# EAGLE design 74clock (EAGLE 5.09)
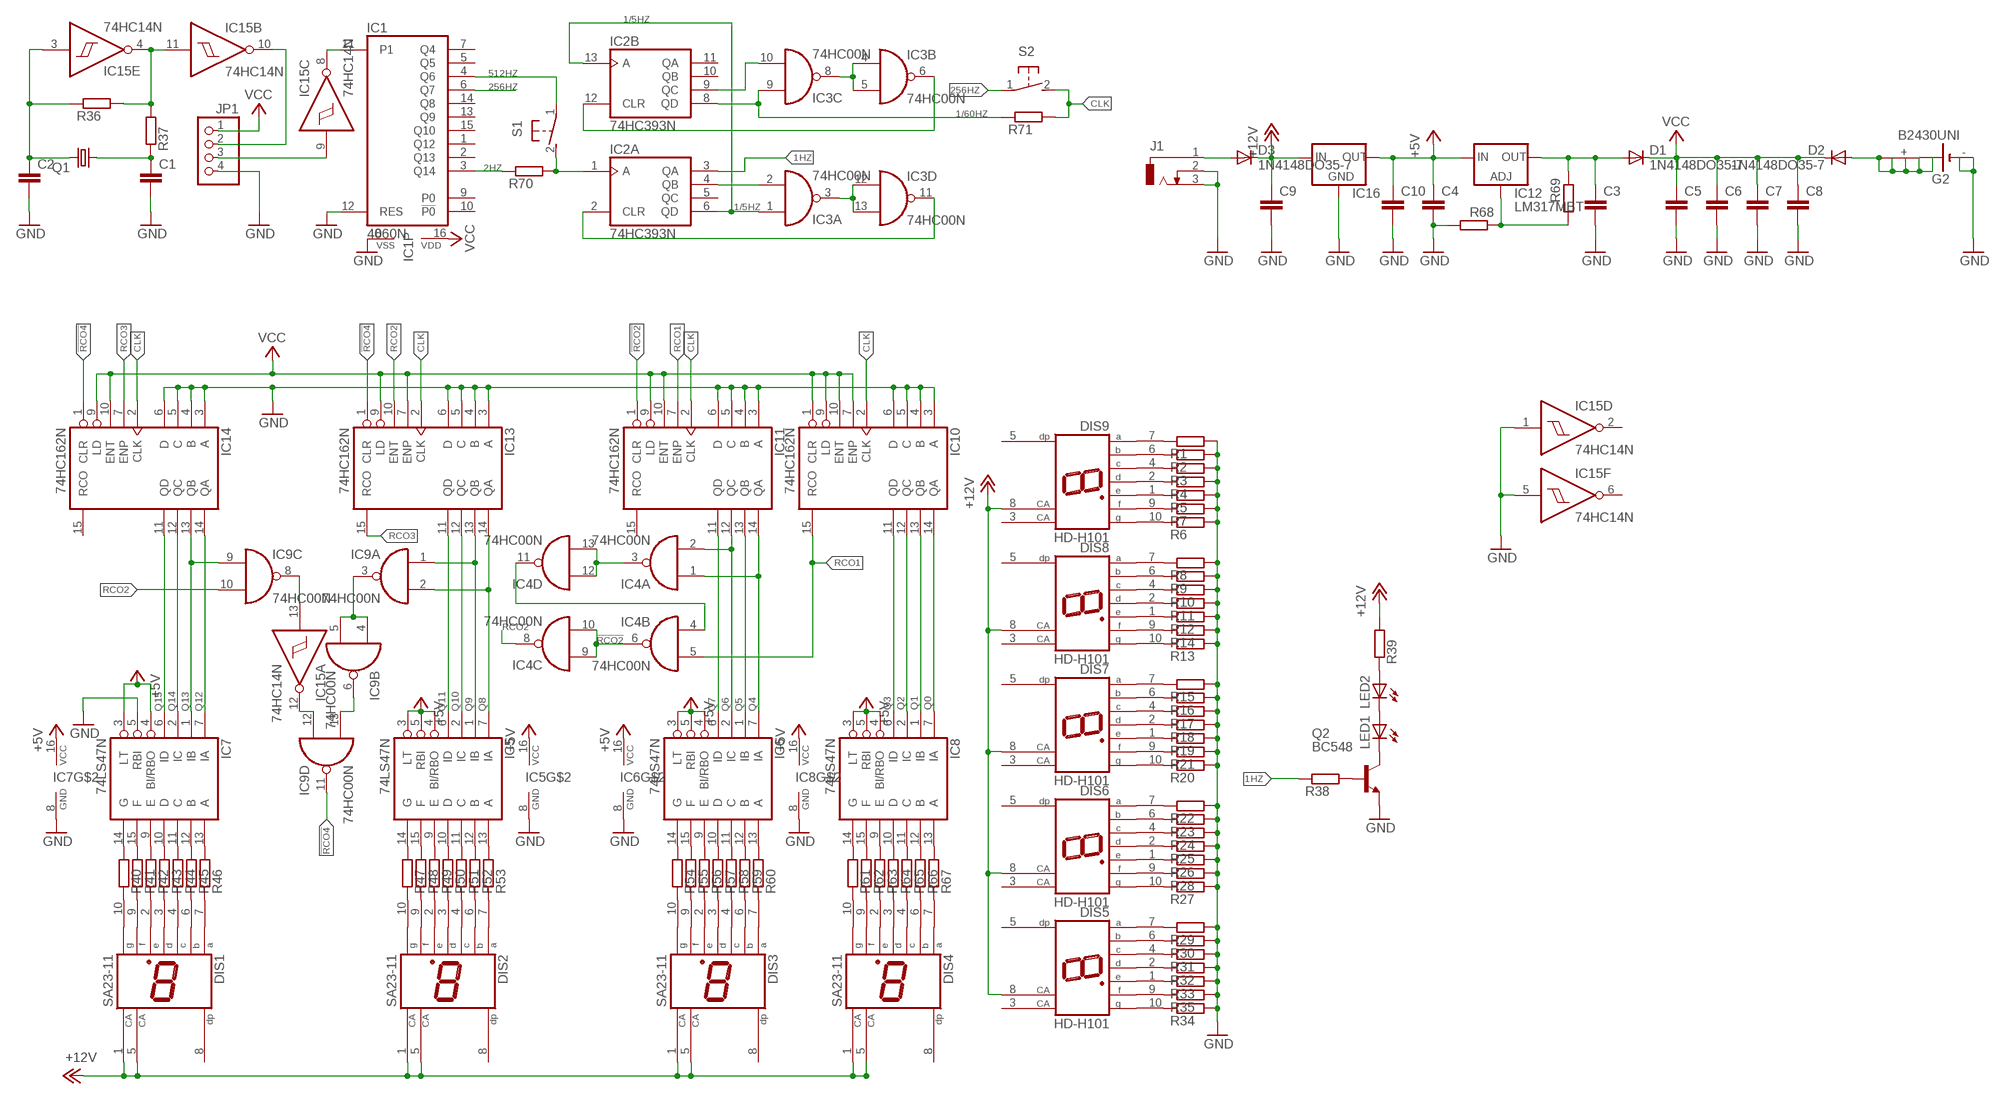
[diagram p0: schematic, sheet 1]

## Parts
C1  C-EU050-024X044  [C050-024X044]
C2  C-EU050-024X044  [C050-024X044]
C3  C-EU050-025X075  [C050-025X075]
C4  C-EU050-025X075  [C050-025X075]
C5  C-EU050-025X075  [C050-025X075]
C6  C-EU050-025X075  [C050-025X075]
C7  C-EU050-025X075  [C050-025X075]
C8  C-EU050-025X075  [C050-025X075]
C9  C-EU050-025X075  [C050-025X075]
C10  C-EU050-025X075  [C050-025X075]
D1  1N4148DO35-7  [DO35-7]
D2  1N4148DO35-7  [DO35-7]
D3  1N4148DO35-7  [DO35-7]
DIS1  SA23-11  [SX23-XX]
DIS2  SA23-11  [SX23-XX]
DIS3  SA23-11  [SX23-XX]
DIS4  SA23-11  [SX23-XX]
DIS5  HD-H101  [HDSP-M]
DIS6  HD-H101  [HDSP-M]
DIS7  HD-H101  [HDSP-M]
DIS8  HD-H101  [HDSP-M]
DIS9  HD-H101  [HDSP-M]
G2  B2430UNI  [B2430UNI]
IC1  4060N  [DIL16]
IC2  74HC393N  [DIL14]
IC3  74HC00N  [DIL14]
IC4  74HC00N  [DIL14]
IC5  74LS47N  [DIL16]
IC6  74LS47N  [DIL16]
IC7  74LS47N  [DIL16]
IC8  74LS47N  [DIL16]
IC9  74HC00N  [DIL14]
IC10  74HC162N  74HC160N  [DIL16]
IC11  74HC162N  74HC160N  [DIL16]
IC12  LM317MBT  [TO220L1]
IC13  74HC162N  74HC160N  [DIL16]
IC14  74HC162N  74HC160N  [DIL16]
IC15  74HC14N  [DIL14]
IC16  78XXL  [78XXL]
J1  DCJ0303  [DCJ0303]
JP1  PINHD-1X4/90  [1X04/90]
LED1  LED5MM  [LED5MM]
LED2  LED5MM  [LED5MM]
Q1  CRYSTALTC38H  [TC38H]
Q2  BC548  [TO92-EBC]
R1  R-EU_0204/5  [0204/5]
R2  R-EU_0204/5  [0204/5]
R3  R-EU_0204/5  [0204/5]
R4  R-EU_0204/5  [0204/5]
R5  R-EU_0204/5  [0204/5]
R6  R-EU_0204/5  [0204/5]
R7  R-EU_0204/5  [0204/5]
R8  R-EU_0204/5  [0204/5]
R9  R-EU_0204/5  [0204/5]
R10  R-EU_0204/5  [0204/5]
R11  R-EU_0204/5  [0204/5]
R12  R-EU_0204/5  [0204/5]
R13  R-EU_0204/5  [0204/5]
R14  R-EU_0204/5  [0204/5]
R15  R-EU_0204/5  [0204/5]
R16  R-EU_0204/5  [0204/5]
R17  R-EU_0204/5  [0204/5]
R18  R-EU_0204/5  [0204/5]
R19  R-EU_0204/5  [0204/5]
R20  R-EU_0204/5  [0204/5]
R21  R-EU_0204/5  [0204/5]
R22  R-EU_0204/5  [0204/5]
R23  R-EU_0204/5  [0204/5]
R24  R-EU_0204/5  [0204/5]
R25  R-EU_0204/5  [0204/5]
R26  R-EU_0204/5  [0204/5]
R27  R-EU_0204/5  [0204/5]
R28  R-EU_0204/5  [0204/5]
R29  R-EU_0204/5  [0204/5]
R30  R-EU_0204/5  [0204/5]
R31  R-EU_0204/5  [0204/5]
R32  R-EU_0204/5  [0204/5]
R33  R-EU_0204/5  [0204/5]
R34  R-EU_0204/5  [0204/5]
R35  R-EU_0204/5  [0204/5]
R36  R-EU_0204/5  [0204/5]
R37  R-EU_0204/5  [0204/5]
R38  R-EU_0204/5  [0204/5]
R39  R-EU_0204/5  [0204/5]
R40  R-EU_0204/5  [0204/5]
R41  R-EU_0204/5  [0204/5]
R42  R-EU_0204/5  [0204/5]
R43  R-EU_0204/5  [0204/5]
R44  R-EU_0204/5  [0204/5]
R45  R-EU_0204/5  [0204/5]
R46  R-EU_0204/5  [0204/5]
R47  R-EU_0204/5  [0204/5]
R48  R-EU_0204/5  [0204/5]
R49  R-EU_0204/5  [0204/5]
R50  R-EU_0204/5  [0204/5]
R51  R-EU_0204/5  [0204/5]
R52  R-EU_0204/5  [0204/5]
R53  R-EU_0204/5  [0204/5]
R54  R-EU_0204/5  [0204/5]
R55  R-EU_0204/5  [0204/5]
R56  R-EU_0204/5  [0204/5]
R57  R-EU_0204/5  [0204/5]
R58  R-EU_0204/5  [0204/5]
R59  R-EU_0204/5  [0204/5]
R60  R-EU_0204/5  [0204/5]
R61  R-EU_0204/5  [0204/5]
R62  R-EU_0204/5  [0204/5]
R63  R-EU_0204/5  [0204/5]
R64  R-EU_0204/5  [0204/5]
R65  R-EU_0204/5  [0204/5]
R66  R-EU_0204/5  [0204/5]
R67  R-EU_0204/5  [0204/5]
R68  R-EU_0204/5  [0204/5]
R69  R-EU_0204/5  [0204/5]
R70  R-EU_0204/5  [0204/5]
R71  R-EU_0204/5  [0204/5]
S1  31-XX  [B3F-31XX]
S2  31-XX  [B3F-31XX]

## Nets
1/5HZ: IC2.6(A:QD) IC2.13(B:A) IC3.1(A:I0)
1/60HZ: IC2.8(B:QD) IC3.9(C:I0) R71.1
1HZ: IC2.3(A:QA) R38.1
2HZ: IC1.3(Q14) R70.1
256HZ: IC1.6(Q7) S2.1(P)
512HZ: IC1.4(Q6) S1.1(P)
!RCO2: IC4.6(B:O) IC4.9(C:I0) IC4.10(C:I1) IC11.1(CLR)
!RCO4: IC9.11(D:O) IC13.1(CLR) IC14.1(CLR)
+5V: C4.1 C10.1 IC5.3(LT) IC5.4(BI/RBO) IC5.5(RBI) IC5.16(VCC) IC6.3(LT) IC6.4(BI/RBO) IC6.5(RBI) IC6.16(VCC) IC7.3(LT) IC7.4(BI/RBO) IC7.16(VCC) IC8.3(LT) IC8.4(BI/RBO) IC8.5(RBI) IC8.16(VCC) IC12.3(IN) IC16.OUT
+12V: C9.1 D3.C DIS1.1(CA) DIS1.5(CA) DIS2.1(CA) DIS2.5(CA) DIS3.1(CA) DIS3.5(CA) DIS4.1(CA) DIS4.5(CA) DIS5.8(CA) DIS6.8(CA) DIS7.8(CA) DIS8.8(CA) DIS9.8(CA) IC16.IN R39.2
CLK: IC10.2(CLK) IC11.2(CLK) IC13.2(CLK) IC14.2(CLK) R71.2 S2.2(S)
GND: C1.2 C2.2 C3.2 C4.2 C5.2 C6.2 C7.2 C8.2 C9.2 C10.2 G2.- G2.-@1(-) IC1.8(VSS) IC1.12(RES) IC5.8(GND) IC6.8(GND) IC7.5(RBI) IC7.8(GND) IC8.8(GND) IC10.3(A) IC10.4(B) IC10.5(C) IC10.6(D) IC11.3(A) IC11.4(B) IC11.5(C) IC11.6(D) IC13.3(A) IC13.4(B) IC13.5(C) IC13.6(D) IC14.3(A) IC14.4(B) IC14.5(C) IC14.6(D) IC15.1(D:I) IC15.5(F:I) IC16.GND J1.2 J1.3 JP1.4 Q2.E R1.2 R2.2 R3.2 R4.2 R5.2 R6.2 R7.2 R8.2 R9.2 R10.2 R11.2 R12.2 R13.2 R14.2 R15.2 R16.2 R17.2 R18.2 R19.2 R20.2 R21.2 R22.2 R23.2 R24.2 R25.2 R26.2 R27.2 R28.2 R29.2 R30.2 R31.2 R32.2 R33.2 R34.2 R35.2 R68.2
N$1: C3.1 D1.A IC12.2(OUT) R69.1
N$2: IC2.4(A:QB) IC3.2(A:I1)
N$3: IC2.9(B:QC) IC3.10(C:I1)
N$4: DIS9.7(A) R1.1
N$5: IC7.14(G) R40.2
N$6: DIS1.10(G) R40.1
N$7: IC7.15(F) R41.2
N$8: DIS1.9(F) R41.1
N$9: IC7.9(E) R42.2
N$10: DIS1.2(E) R42.1
N$11: IC7.10(D) R43.2
N$12: DIS9.6(B) R2.1
N$13: DIS9.4(C) R3.1
N$14: DIS9.2(D) R4.1
N$15: DIS9.1(E) R5.1
N$16: DIS9.10(G) R6.1
N$17: DIS9.9(F) R7.1
N$18: DIS8.7(A) R8.1
N$19: DIS8.6(B) R9.1
N$20: DIS8.4(C) R10.1
N$21: DIS8.2(D) R11.1
N$22: DIS8.1(E) R12.1
N$23: DIS8.10(G) R13.1
N$24: DIS1.3(D) R43.1
N$25: IC7.11(C) R44.2
N$26: DIS1.4(C) R44.1
N$27: IC7.12(B) R45.2
N$28: DIS1.6(B) R45.1
N$29: IC7.13(A) R46.2
N$30: DIS1.7(A) R46.1
N$31: DIS2.10(G) R47.1
N$32: DIS2.9(F) R48.1
N$33: DIS2.2(E) R49.1
N$34: DIS2.3(D) R50.1
N$35: DIS2.4(C) R51.1
N$36: DIS2.6(B) R52.1
N$37: DIS2.7(A) R53.1
N$38: IC5.14(G) R47.2
N$39: IC5.15(F) R48.2
N$40: IC5.9(E) R49.2
N$41: IC5.10(D) R50.2
N$42: IC5.11(C) R51.2
N$43: IC5.12(B) R52.2
N$44: IC5.13(A) R53.2
N$45: DIS8.9(F) R14.1
N$46: DIS7.7(A) R15.1
N$47: DIS7.6(B) R16.1
N$48: DIS7.4(C) R17.1
N$49: DIS7.2(D) R18.1
N$50: DIS7.1(E) R19.1
N$51: DIS7.10(G) R20.1
N$52: DIS7.9(F) R21.1
N$53: DIS6.7(A) R22.1
N$54: DIS6.6(B) R23.1
N$55: DIS6.4(C) R24.1
N$56: DIS6.2(D) R25.1
N$57: DIS6.1(E) R26.1
N$58: DIS6.10(G) R27.1
N$59: DIS6.9(F) R28.1
N$60: DIS5.7(A) R29.1
N$61: DIS5.6(B) R30.1
N$62: DIS5.4(C) R31.1
N$63: DIS5.2(D) R32.1
N$64: DIS5.1(E) R33.1
N$65: DIS5.10(G) R34.1
N$66: DIS5.9(F) R35.1
N$67: IC15.9(C:I) JP1.3
N$68: IC15.10(B:O) JP1.2
N$69: IC4.3(A:O) IC4.12(D:I0) IC4.13(D:I1)
N$70: D3.A J1.1
N$71: IC4.4(B:I0) IC4.11(D:O)
N$72: IC9.8(C:O) IC15.13(A:I)
N$73: IC9.3(A:O) IC9.4(B:I0) IC9.5(B:I1)
N$74: IC9.6(B:O) IC9.13(D:I1)
N$75: IC9.12(D:I0) IC15.12(A:O)
N$77: IC3.3(A:O) IC3.12(D:I0) IC3.13(D:I1)
N$78: C2.1 IC15.3(E:I) Q1.2 R36.1
N$79: C1.1 Q1.1 R37.1
N$80: Q2.B R38.2
N$81: IC15.4(E:O) IC15.11(B:I) R36.2 R37.2
N$82: LED1.K(C) Q2.C
N$83: LED1.A LED2.K(C)
N$84: LED2.A R39.1
N$86: IC2.2(A:CLR) IC3.11(D:O)
N$87: IC1.11(P1) IC15.8(C:O)
N$88: DIS3.10(G) R54.1
N$89: IC3.4(B:I0) IC3.5(B:I1) IC3.8(C:O)
N$90: IC2.12(B:CLR) IC3.6(B:O)
N$91: DIS3.9(F) R55.1
N$92: DIS3.2(E) R56.1
N$93: DIS3.3(D) R57.1
N$94: DIS3.4(C) R58.1
N$95: DIS3.6(B) R59.1
N$96: DIS3.7(A) R60.1
N$97: IC6.14(G) R54.2
N$98: IC6.15(F) R55.2
N$99: IC6.9(E) R56.2
N$100: IC6.10(D) R57.2
N$101: IC6.11(C) R58.2
N$102: IC6.12(B) R59.2
N$103: IC6.13(A) R60.2
N$104: DIS4.10(G) R61.1
N$105: DIS4.9(F) R62.1
N$106: DIS4.2(E) R63.1
N$107: DIS4.3(D) R64.1
N$108: DIS4.4(C) R65.1
N$109: DIS4.6(B) R66.1
N$110: DIS4.7(A) R67.1
N$111: IC8.14(G) R61.2
N$112: IC8.15(F) R62.2
N$113: IC8.9(E) R63.2
N$114: IC8.10(D) R64.2
N$115: IC8.11(C) R65.2
N$116: IC8.12(B) R66.2
N$117: IC8.13(A) R67.2
N$118: IC12.1(ADJ) R68.1 R69.2
N$119: D2.A G2.+ G2.+@1(+) G2.+@2(+) G2.+@3(+) G2.+@4(+)
N$121: IC2.1(A:A) R70.2 S1.2(S)
Q0: IC8.7(IA) IC10.14(QA)
Q1: IC8.1(IB) IC10.13(QB)
Q2: IC8.2(IC) IC10.12(QC)
Q3: IC8.6(ID) IC10.11(QD)
Q4: IC4.1(A:I0) IC6.7(IA) IC11.14(QA)
Q5: IC6.1(IB) IC11.13(QB)
Q6: IC4.2(A:I1) IC6.2(IC) IC11.12(QC)
Q7: IC6.6(ID) IC11.11(QD)
Q8: IC5.7(IA) IC9.2(A:I1) IC13.14(QA)
Q9: IC5.1(IB) IC9.1(A:I0) IC13.13(QB)
Q10: IC5.2(IC) IC13.12(QC)
Q11: IC5.6(ID) IC13.11(QD)
Q12: IC7.7(IA) IC14.14(QA)
Q13: IC7.1(IB) IC9.9(C:I0) IC14.13(QB)
Q14: IC7.2(IC) IC14.12(QC)
Q15: IC7.6(ID) IC14.11(QD)
RCO1: IC4.5(B:I1) IC10.15(RCO) IC11.7(ENP)
RCO2: IC4.8(C:O) IC9.10(C:I1) IC13.10(ENT)
RCO3: IC13.15(RCO) IC14.7(ENP)
VCC: C5.1 C6.1 C7.1 C8.1 D1.C D2.C IC1.16(VDD) IC10.1(CLR) IC10.7(ENP) IC10.9(LD) IC10.10(ENT) IC11.9(LD) IC11.10(ENT) IC13.7(ENP) IC13.9(LD) IC14.9(LD) IC14.10(ENT) JP1.1
Unconnected: DIS1.8(DP) DIS2.8(DP) DIS3.8(DP) DIS4.8(DP) DIS5.3(CA) DIS5.5(DP) DIS6.3(CA) DIS6.5(DP) DIS7.3(CA) DIS7.5(DP) DIS8.3(CA) DIS8.5(DP) DIS9.3(CA) DIS9.5(DP) IC1.1(Q12) IC1.2(Q13) IC1.5(Q5) IC1.7(Q4) IC1.9(P0) IC1.10(!P0) IC1.13(Q9) IC1.14(Q8) IC1.15(Q10) IC2.5(A:QC) IC2.10(B:QB) IC2.11(B:QA) IC11.15(RCO) IC14.15(RCO) IC15.2(D:O) IC15.6(F:O)

## Power pins joined to a net without a drawn wire
GND: IC2.7(P:GND) IC3.7(P:GND) IC4.7(P:GND) IC9.7(P:GND) IC10.8(GND) IC11.8(GND) IC13.8(GND) IC14.8(GND) IC15.7(P:GND)
VCC: IC2.14(P:VCC) IC3.14(P:VCC) IC4.14(P:VCC) IC9.14(P:VCC) IC10.16(VCC) IC11.16(VCC) IC13.16(VCC) IC14.16(VCC) IC15.14(P:VCC)

## Library data of the parts
C1-C10 = rcl:C-EU: CAPACITOR, European symbol
D1-D3 = diode:1N4148: DIODE high speed (Philips)
DIS1-DIS4 = display-kingbright:SA23-11: LED DISPLAY 1-character 7 segment, decimal point right
DIS5-DIS9 = display-hp:HD-H101: LED DISPLAY 1-character 7 segment, decimal point right
G2 = battery:B2430UNI: LI BATTERY
IC1 = 40xx:4060: 14-stage binary/ripple COUNTER
IC2 = 74xx-eu:74*393: Dual 4-bit decade and binary COUNTER
IC3 IC4 IC9 = 74xx-eu:74*00: Quad 2-input NAND gate
IC5-IC8 = 74xx-eu:74*47: BCD to seven segment DECODER/DRIVER Source: http://www.ee.washington.edu/stores/DataSheets/74ls/74ls47.pdf
IC10 IC11 IC13 IC14 = 74xx-eu:74*160: Synchronous 4-bit COUNTER
IC12 = v-reg:LM317?*: 500 mA Adjustable Output Positive Voltage Regulator Source: http://www.onsemi.co.jp .. LM317M-D.PDF
IC15 = 74xx-eu:74*14: Hex schmitt trigger INVERTER
IC16 = v-reg:78XXL: VOLTAGE REGULATOR
J1 = con-jack:DCJ0303: DC POWER JACK Source: DCJ0303.pdf
JP1 = pinhead:PINHD-1X4: PIN HEADER
LED1 LED2 = led:LED: LED OSRAM: - CHIPLED LG R971, LG N971, LY N971, LG Q971, LY Q971, LO R971, LY R971 LH N974, LH R974 LS Q976, LO Q976, LY Q976 LO Q996 - Hyper CHIPLED LW Q18S LB Q993, LB Q99A, LB R99A - SideLED LS A670, LO A670, LY A670, LG A670, LP A670 LB A673, LV A673, LT A673, LW A673 LH A674 LY A675 LS A676, LA A676, LO A676, LY A676, LW A676 LS A679, LY A679, LG A679 - Hyper Micro SIDELED® LS Y876, LA Y876, LO Y876, LY Y876 LT Y87S - SmartLED LW L88C, LW L88S LB L89C, LB L89S, LG L890 LS L89K, LO L89K, LY L89K LS L896, LA L896, LO L896, LY L896 - TOPLED LS T670, LO T670, LY T670, LG T670, LP T670 LSG T670, LSP T670, LSY T670, LOP T670, LYG T670 LG T671, LOG T671, LSG T671 LB T673, LV T673, LT T673, LW T673 LH T674 LS T676, LA T676, LO T676, LY T676, LB T676, LH T676, LSB T676, LW T676 LB T67C, LV T67C, LT T67C, LS T67K, LO T67K, LY T67K, LW E67C LS E67B, LA E67B, LO E67B, LY E67B, LB E67C, LV E67C, LT E67C LW T67C LS T679, LY T679, LG T679 LS T770, LO T770, LY T770, LG T770, LP T770 LB T773, LV T773, LT T773, LW T773 LH T774 LS E675, LA E675, LY E675, LS T675 LS T776, LA T776, LO T776, LY T776, LB T776 LHGB T686 LT T68C, LB T68C - Hyper Mini TOPLED® LB M676 - Mini TOPLED Santana® LG M470 LS M47K, LO M47K, LY M47K Source: http://www.osram.convergy.de LUXEON: - LUMILED® LXK2-PW12-R00, LXK2-PW12-S00, LXK2-PW14-U00, LXK2-PW14-V00 LXK2-PM12-R00, LXK2-PM12-S00, LXK2-PM14-U00 LXK2-PE12-Q00, LXK2-PE12-R00, LXK2-PE12-S00, LXK2-PE14-T00, LXK2-PE14-U00 LXK2-PB12-K00, LXK2-PB12-L00, LXK2-PB12-M00, LXK2-PB14-N00, LXK2-PB14-P00, LXK2-PB14-Q00 LXK2-PR12-L00, LXK2-PR12-M00, LXK2-PR14-Q00, LXK2-PR14-R00 LXK2-PD12-Q00, LXK2-PD12-R00, LXK2-PD12-S00 LXK2-PH12-R00, LXK2-PH12-S00 LXK2-PL12-P00, LXK2-PL12-Q00, LXK2-PL12-R00 Source: www.luxeon.com KINGBRIGHT: KA-3528ASYC Source: www.kingbright.com
Q1 = crystal:CRYSTAL: CRYSTAL
Q2 = transistor-npn:BC548*: NPN Transistor
R1-R71 = rcl:R-EU_: RESISTOR, European symbol
S1 S2 = switch-omron:31-XX: OMRON SWITCH

## Board
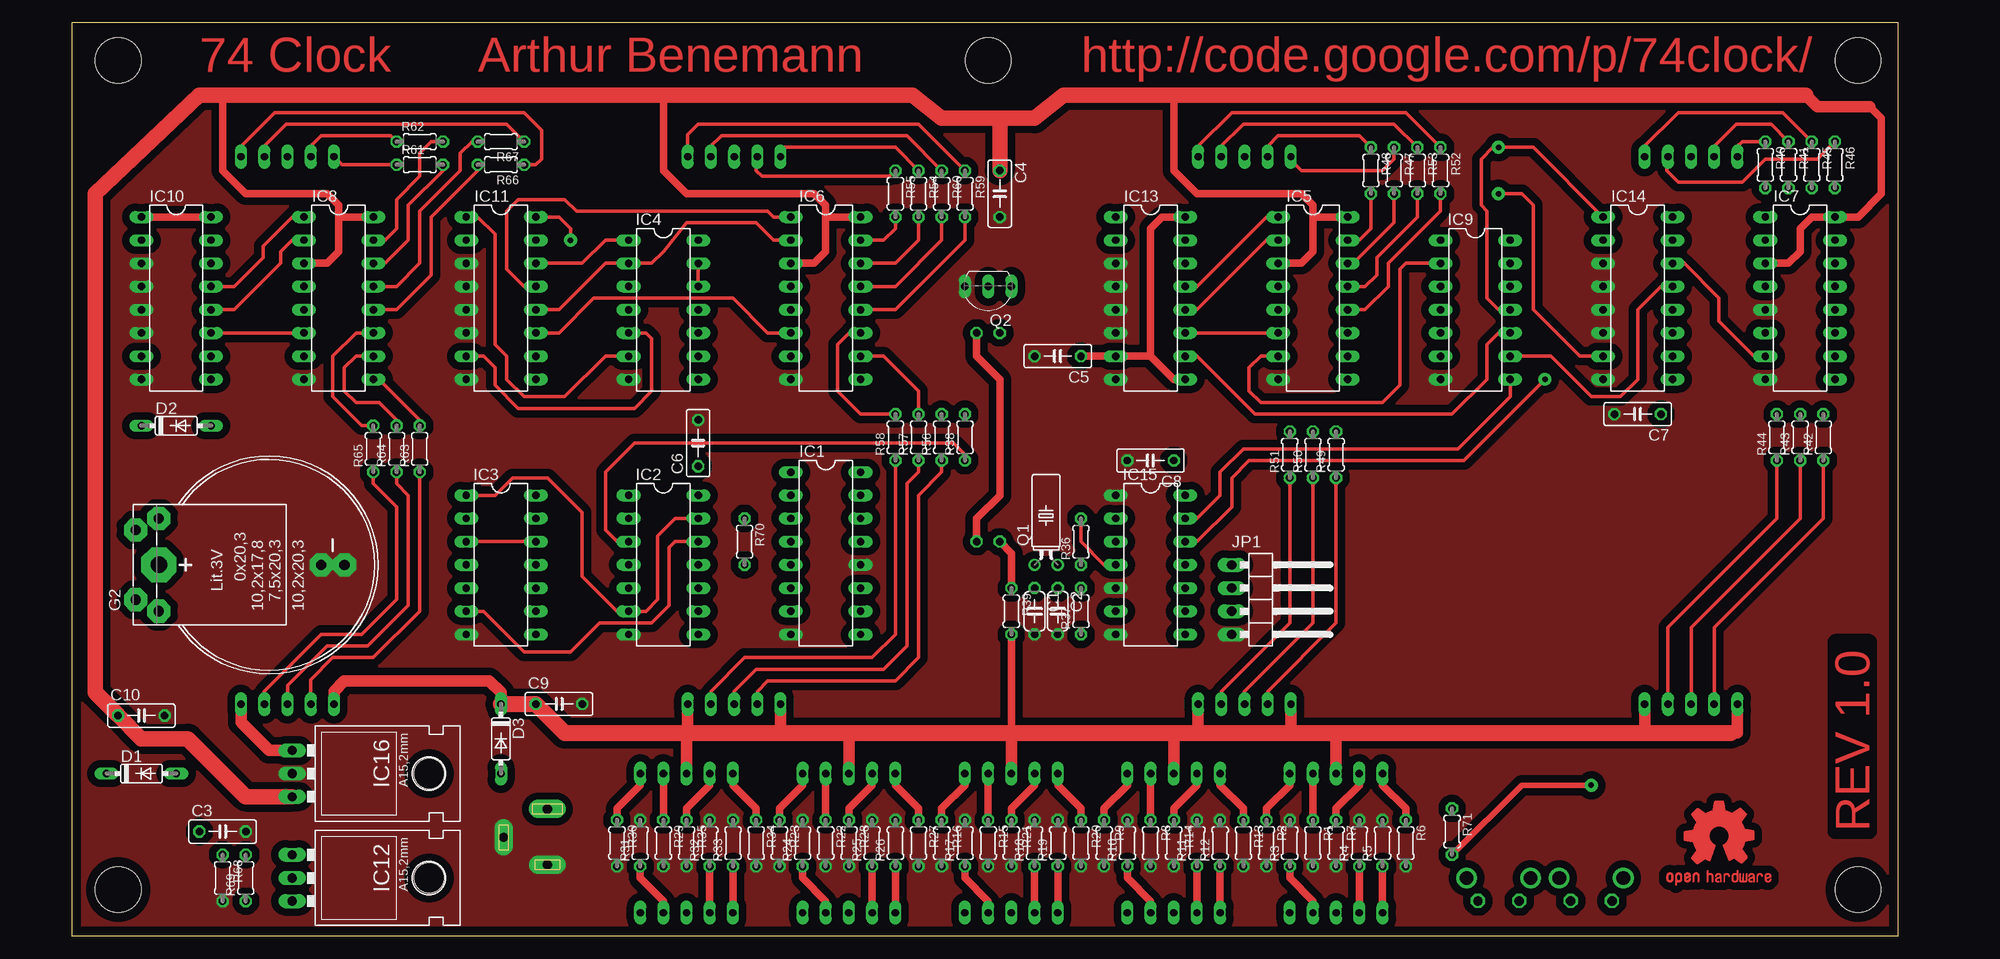
[diagram p1: board, top side]
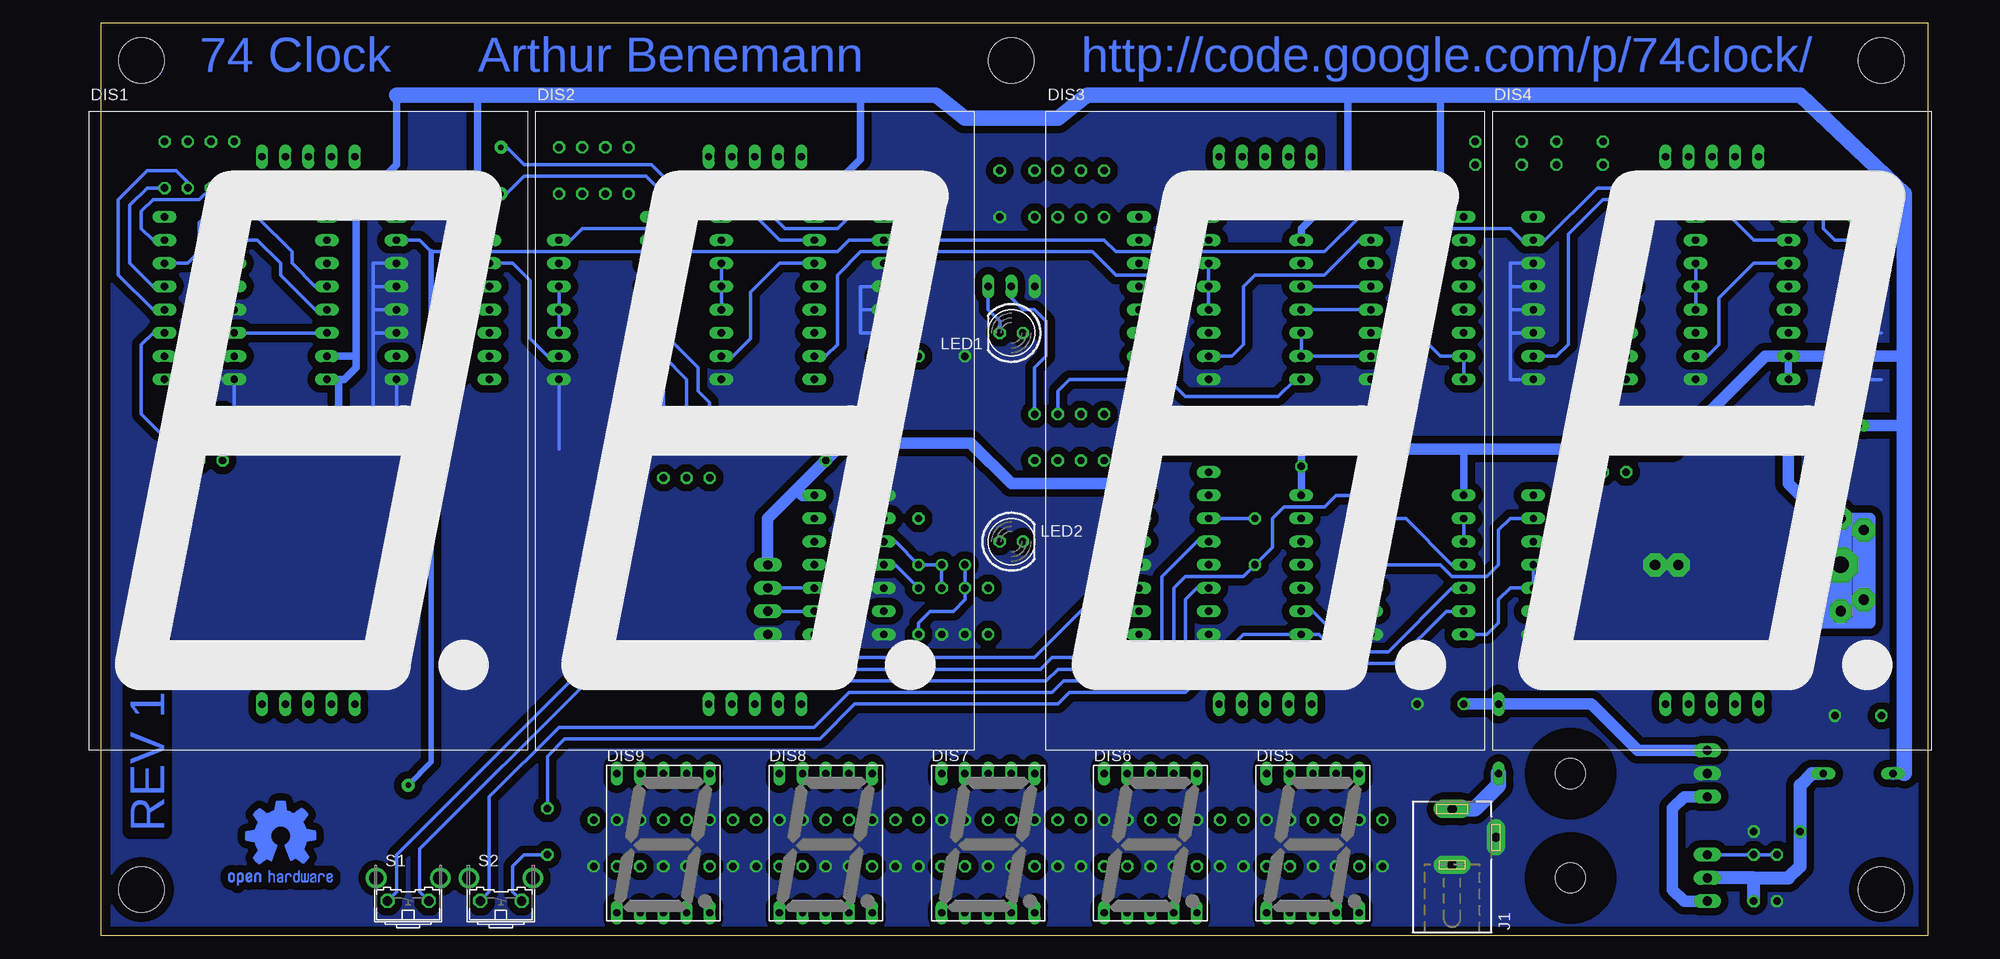
[diagram p2: board, bottom side, seen from below]

Size 200 x 100 mm. Coordinates in mm from the lower left corner, seen from the top.
Outline: 200,0 200,100 0,100 0,0 200,0
Copper layers (1*16): Top 0.035mm / dielectric 1.5mm / Bottom 0.035mm
Design rules "default *": minimum track width 10mil, minimum drill 20mil, track to track 15mil, track to pad 16mil, pad to pad 16mil, via to via 16mil, smd to smd 8mil, copper to edge 40mil, drill to drill 8mil, minimum pad ring 10mil, minimum via ring 8mil, stop-mask expansion 4mil, vias tented up to drill 0mil, thermal gap 10mil
Holes 5 mm at 195.58,95.89 5.08,95.89 5.08,5.08 195.58,5.08 100.33,95.89

### Footprints (pad centres in the part's own frame; a part is rotated, then mirrored left to right if it is on the bottom)
C050-024X044 = drill 0.813 octagon: 1 -2.54,0; 2 2.54,0
C050-025X075 = drill 0.813 octagon: 1 -2.54,0; 2 2.54,0
DO35-7 = drill 0.813 long: A 3.81,0; C -3.81,0
SX23-XX = drill 0.813 long: 1 18.923,5.08; 2 21.463,5.08; 3 24.003,5.08; 4 26.543,5.08; 5 29.083,5.08; 6 29.083,65.024; 7 26.543,65.024; 8 24.003,65.024; 9 21.463,65.024; 10 18.923,65.024
HDSP-M = drill 0.813 long: 1 -5.08,-7.62; 2 -2.54,-7.62; 3 0,-7.62; 4 2.54,-7.62; 5 5.08,-7.62; 6 5.08,7.62; 7 2.54,7.62; 8 0,7.62; 9 -2.54,7.62; 10 -5.08,7.62
B2430UNI = drill 1.118 pad 2.54 octagon: + 3.81,14.605; +@1 -3.81,14.605; +@2 -5.08,12.065; +@3 5.08,12.065; - 0,-5.715; -@1 0,-8.255 | drill 1.803 pad 3.81 octagon: +@4 0,12.065
DIL16 = drill 0.813 long: 1 -8.89,-3.81; 2 -6.35,-3.81; 3 -3.81,-3.81; 4 -1.27,-3.81; 5 1.27,-3.81; 6 3.81,-3.81; 7 6.35,-3.81; 8 8.89,-3.81; 9 8.89,3.81; 10 6.35,3.81; 11 3.81,3.81; 12 1.27,3.81; 13 -1.27,3.81; 14 -3.81,3.81; 15 -6.35,3.81; 16 -8.89,3.81
DIL14 = drill 0.813 long: 1 -7.62,-3.81; 2 -5.08,-3.81; 3 -2.54,-3.81; 4 0,-3.81; 5 2.54,-3.81; 6 5.08,-3.81; 7 7.62,-3.81; 8 7.62,3.81; 9 5.08,3.81; 10 2.54,3.81; 11 0,3.81; 12 -2.54,3.81; 13 -5.08,3.81; 14 -7.62,3.81
TO220L1 = drill 1.016 long: 1 -2.54,-3.81; 2 0,-3.81; 3 2.54,-3.81 | hole 3.302: 0,11.176
78XXL = drill 1.016 long: GND 0,-3.81; IN -2.54,-3.81; OUT 2.54,-3.81 | hole 3.302: 0,11.176
DCJ0303 = drill 1 pad 2 long: 1 0,3.1; 2 4.8,0; 3 0,-3
1X04/90 = drill 1.016 long: 1 -3.81,-3.81; 2 -1.27,-3.81; 3 1.27,-3.81; 4 3.81,-3.81
LED5MM = drill 0.813 octagon: A -1.27,0; K 1.27,0
TC38H = drill 0.813 round: 1 -1.27,0; 2 1.27,0
TO92-EBC = drill 0.813 long: B 0,-1.27; C -2.54,-1.27; E 2.54,-1.27
0204/5 = drill 0.813 octagon: 1 -2.54,0; 2 2.54,0
B3F-31XX = drill 1.016 octagon: 1 -2.261,-1.245; 2 2.261,-1.245 | drill 1.499 pad 2.159 round: 3 -3.505,1.245; 4 3.505,1.245

### Placement (x,y rotation side)
C1  22pF  [C050-024X044]  105.41,35.56 270 top
C2  22pF  [C050-024X044]  107.95,35.56 270 top
C3  100nF  [C050-025X075]  16.51,11.43 0 top
C4  100nF  [C050-025X075]  101.6,81.28 270 top
C5  100nF  [C050-025X075]  107.95,63.5 180 top
C6  100nF  [C050-025X075]  68.58,53.98 90 top
C7  100nF  [C050-025X075]  171.45,57.15 180 top
C8  100nF  [C050-025X075]  118.11,52.07 180 top
C9  100nF  [C050-025X075]  53.34,25.4 0 top
C10  100nF  [C050-025X075]  7.62,24.13 0 top
D1  7.62,17.78 0 top
D2  11.43,55.88 0 top
D3  46.99,21.59 270 top
DIS1  201.29,20.32 0 bottom
DIS2  152.4,20.32 0 bottom
DIS3  96.52,20.32 0 bottom
DIS4  47.62,20.32 0 bottom
DIS5  67.31,10.16 0 bottom
DIS6  85.09,10.16 0 bottom
DIS7  102.87,10.16 0 bottom
DIS8  120.65,10.16 0 bottom
DIS9  138.43,10.16 0 bottom
G2  CR2032 Socket  [B2430UNI]  21.59,40.64 90 top
IC1  82.55,41.91 270 top
IC2  64.77,40.64 270 top
IC3  46.99,40.64 270 top
IC4  64.77,68.58 270 top
IC5  135.89,69.85 270 top
IC6  82.55,69.85 270 top
IC7  189.23,69.85 270 top
IC8  29.21,69.85 270 top
IC9  153.67,68.58 270 top
IC10  11.43,69.85 270 top
IC11  46.99,69.85 270 top
IC12  27.94,6.35 270 top
IC13  118.11,69.85 270 top
IC14  171.45,69.85 270 top
IC15  40106  [DIL14]  118.11,40.64 270 top
IC16  7805  [78XXL]  27.94,17.78 270 top
J1  52.07,10.79 0 bottom
JP1  130.81,36.83 270 top
LED1  LED 5mm RED  [LED5MM]  100.33,66.04 180 bottom
LED2  LED 5mm RED  [LED5MM]  100.33,43.18 0 bottom
Q1  32kHz  [TC38H]  106.68,40.64 0 top
Q2  100.33,69.85 180 top
R1  680R  [0204/5]  135.89,10.16 270 top
R2  680R  [0204/5]  130.81,10.16 270 top
R3  680R  [0204/5]  133.35,10.16 90 top
R4  680R  [0204/5]  140.97,10.16 90 top
R5  680R  [0204/5]  143.51,10.16 90 top
R6  680R  [0204/5]  146.05,10.16 270 top
R7  680R  [0204/5]  138.43,10.16 270 top
R8  680R  [0204/5]  118.11,10.16 270 top
R9  680R  [0204/5]  113.03,10.16 270 top
R10  680R  [0204/5]  115.57,10.16 90 top
R11  680R  [0204/5]  123.19,10.16 90 top
R12  680R  [0204/5]  125.73,10.16 90 top
R13  680R  [0204/5]  128.27,10.16 270 top
R14  680R  [0204/5]  120.65,10.16 270 top
R15  680R  [0204/5]  100.33,10.16 270 top
R16  680R  [0204/5]  95.25,10.16 270 top
R17  680R  [0204/5]  97.79,10.16 90 top
R18  680R  [0204/5]  105.41,10.16 90 top
R19  680R  [0204/5]  107.95,10.16 90 top
R20  680R  [0204/5]  110.49,10.16 270 top
R21  680R  [0204/5]  102.87,10.16 270 top
R22  680R  [0204/5]  82.55,10.16 270 top
R23  680R  [0204/5]  77.47,10.16 270 top
R24  680R  [0204/5]  80.01,10.16 90 top
R25  680R  [0204/5]  87.63,10.16 90 top
R26  680R  [0204/5]  90.17,10.16 90 top
R27  680R  [0204/5]  92.71,10.16 270 top
R28  680R  [0204/5]  85.09,10.16 270 top
R29  680R  [0204/5]  64.77,10.16 270 top
R30  680R  [0204/5]  59.69,10.16 270 top
R31  680R  [0204/5]  62.23,10.16 90 top
R32  680R  [0204/5]  69.85,10.16 90 top
R33  680R  [0204/5]  72.39,10.16 90 top
R34  680R  [0204/5]  74.93,10.16 270 top
R35  67.31,10.16 270 top
R36  10M  [0204/5]  110.49,43.18 90 top
R37  10k  [0204/5]  110.49,35.56 90 top
R38  10k  [0204/5]  97.79,54.61 90 top
R39  680R  [0204/5]  102.87,35.56 270 top
R40  330R  [0204/5]  185.42,84.45 270 top
R41  330R  [0204/5]  187.96,84.45 270 top
R42  330R  [0204/5]  191.77,54.61 90 top
R43  330R  [0204/5]  189.23,54.61 90 top
R44  330R  [0204/5]  186.69,54.61 90 top
R45  330R  [0204/5]  190.5,84.45 270 top
R46  330R  [0204/5]  193.04,84.45 270 top
R47  330R  [0204/5]  144.78,83.82 270 top
R48  330R  [0204/5]  142.24,83.82 270 top
R49  330R  [0204/5]  138.43,52.7 90 top
R50  330R  [0204/5]  135.89,52.7 90 top
R51  330R  [0204/5]  133.35,52.7 90 top
R52  330R  [0204/5]  149.86,83.82 270 top
R53  330R  [0204/5]  147.32,83.82 270 top
R54  330R  [0204/5]  92.71,81.28 270 top
R55  330R  [0204/5]  90.17,81.28 270 top
R56  330R  [0204/5]  95.25,54.61 90 top
R57  330R  [0204/5]  92.71,54.61 90 top
R58  330R  [0204/5]  90.17,54.61 90 top
R59  330R  [0204/5]  97.79,81.28 270 top
R60  330R  [0204/5]  95.25,81.28 270 top
R61  330R  [0204/5]  38.1,84.45 0 top
R62  330R  [0204/5]  38.1,87 0 top
R63  330R  [0204/5]  38.1,53.34 90 top
R64  330R  [0204/5]  35.56,53.34 90 top
R65  330R  [0204/5]  33.02,53.34 90 top
R66  46.99,84.45 180 top
R67  330R  [0204/5]  46.99,87 180 top
R68  330R  [0204/5]  16.51,6.35 270 top
R69  220R  [0204/5]  19.05,6.35 90 top
R70  1k  [0204/5]  73.66,43.18 270 top
R71  1k  [0204/5]  151.13,11.43 270 top
S1  166.37,5.08 0 bottom
S2  156.21,5.08 0 bottom

### Tracks (layer width: path | path; a pad name or v marks a point on that pad's centre or on a via)
1/5HZ
  Top 0.406: IC2.13 66.04,45.72 64.14,43.81 64.14,36.83 62.87,35.56 IC2.6 59.69,35.56 55.88,39.37 55.88,46.35 52.07,50.16 48.26,50.16 46.35,48.26 IC3.1
1/60HZ
  Bottom 0.406: 50.16,35.56 IC3.9 52.7,35.56 58.42,29.84 63.5,29.84 66.67,33.02 IC2.8 74.93,33.02 81.28,26.67 93.98,26.67 95.25,25.4 117.47,25.4 121.28,21.59 149.22,21.59 151.13,19.68 R71.1
1HZ
  Top 0.406: IC2.3 59.69,43.18 58.42,44.45 58.42,50.8 61.59,53.98 96.52,53.98 97.79,52.7 R38.1
2HZ
  Bottom 0.406: R70.1 IC1.3
256HZ
  Bottom 0.406: IC1.6 80.01,38.1 81.28,36.83 81.28,29.21 82.55,27.94 94.61,27.94 95.89,26.67 118.11,26.67 121.92,22.86 149.86,22.86 157.48,15.24 157.48,4.83 S2.1
512HZ
  Bottom 0.406: IC1.4 80.01,43.18 83.82,39.37 83.82,31.75 85.09,30.48 95.89,30.48 97.16,29.21 147.32,29.21 167.64,8.89 167.64,4.83 S1.1
!RCO2
  Top 0.406: IC11.1 44.45,78.74 46.35,76.83 46.35,64.77 47.62,63.5 47.62,60.96 49.53,59.05 53.98,59.05 58.42,63.5 IC4.6
  Bottom 0.406: IC4.6 IC4.9 IC4.10
!RCO4  (via drill 0.6 pad 1.42)
  Top 0.406: IC14.1 160.02,86.36 v156.21,86.36 155.57,86.36 154.31,85.09 154.31,80.01 154.94,79.38 154.94,69.85 156.21,68.58 IC9.11
  Bottom 0.406: IC13.1 118.11,78.74 119.38,77.47 125.09,77.47 130.18,82.55 137.79,82.55 139.7,84.45 153.67,84.45 155.57,86.36 v156.21,86.36
+5V
  Top 0.813: 29.21,78.74 IC8.16 | 29.21,78.74 29.21,80.01 27.94,81.28 19.05,81.28 16.51,83.82 16.51,92.08 | 82.55,78.74 82.55,80.01 81.28,81.28 67.31,81.28 64.77,83.82 64.77,92.08 | 135.89,78.74 IC5.16 | 120.65,92.08 120.65,83.82 123.19,81.28 134.62,81.28 135.89,80.01 135.89,78.74 | IC7.3 187.96,73.66 189.23,74.93 189.23,77.47 190.5,78.74 IC7.16 195.58,78.74 198.12,81.28 198.12,89.53 196.85,90.81 | 135.89,78.74 135.89,74.93 134.62,73.66 IC5.3 | 82.55,78.74 IC6.16 | 82.55,78.74 82.55,74.93 81.28,73.66 IC6.3 | 29.21,78.74 29.21,74.93 27.94,73.66 IC8.3
  Top 1.27: 189.87,92.08 191.13,90.81 196.85,90.81
  Top 1.676: 189.87,92.08 120.65,92.08 108.58,92.08 105.41,89.53 101.6,89.53 | 101.6,89.53 95.25,89.53 92.08,92.08 64.77,92.08 16.51,92.08 13.97,92.08 2.54,81.28 2.54,26.67 C10.1 7.62,21.59 12.7,21.59 19.05,15.24 IC16.OUT | 101.6,89.53 C4.1
  Bottom 0.406: IC7.4 IC7.3 | IC8.5 IC8.4 IC8.3 | IC6.3 IC6.4 IC6.5 | IC5.5 IC5.4 IC5.3
  Bottom 1.27: IC16.OUT 26.67,15.24 27.94,13.97 27.94,5.08 26.67,3.81 IC12.3
+12V
  Top 0.406: 67.31,22.23 67.44,22.35 | 85.09,22.23 77.6,22.35 | 171.45,22.23 172.21,22.35 | 127,22.23 127.13,22.1
  Top 0.813: 102.87,22.23 R39.2
  Top 1.27: 67.44,22.35 DIS3.5 | 77.6,22.35 DIS3.1 | 172.21,22.35 DIS1.5 | 138.43,22.23 DIS9.8 | 120.65,22.23 DIS8.8 | 102.87,22.23 DIS7.8 | 85.09,22.23 DIS6.8 | 67.31,22.23 DIS5.8 | DIS2.1 133.48,22.35 133.35,22.23 | DIS2.5 123.32,22.35 123.19,22.23 | DIS1.1 182.37,22.23 181.61,22.23 | DIS4.1 28.7,26.8 29.84,27.94 45.72,27.94 46.99,26.67 D3.C | DIS4.5 18.54,23.37 21.59,20.32 IC16.IN
  Top 1.778: 181.61,22.23 171.45,22.23 138.43,22.23 133.35,22.23 127,22.23 123.19,22.23 120.65,22.23 102.87,22.23 85.09,22.23 67.31,22.23 53.98,22.23 C9.1 D3.C
  Bottom 1.27: IC16.IN 31.75,20.32 36.83,25.4 D3.C C9.1
CLK  (via drill 0.6 pad 1.42)
  Top 0.61: v166.37,16.51 158.75,16.51 R71.2
  Bottom 0.406: IC10.2 10.16,76.2 11.43,77.47 11.43,80.64 12.7,81.92 36.2,81.92 41.91,76.2 IC11.2 44.45,76.2 45.72,77.47 52.7,77.47 53.98,78.74 62.23,78.74 66.04,74.93 88.9,74.93 90.17,76.2 IC13.2 118.11,76.2 119.38,74.93 163.83,74.93 165.1,76.2 IC14.2 | R71.2 153.67,8.89 154.94,7.62 154.94,4.83 S2.2
  Bottom 0.61: 163.83,74.93 163.83,19.05 v166.37,16.51
GND
  Bottom 0.406: 5.08,60.96 IC10.8 | 5.08,66.04 IC10.6 IC10.5 IC10.4 | 45.72,66.04 45.72,60.96 IC11.8 | 45.72,66.04 IC11.6 | 45.72,68.58 IC11.5 | 45.72,66.04 45.72,68.58 | 45.72,71.12 IC11.4 | 45.72,68.58 45.72,71.12 | IC11.3 45.72,73.66 45.72,71.12 | 170.18,54.61 185.42,54.61 IC7.8 186.69,60.96 187.96,62.23 187.96,67.31 186.69,68.58 IC7.5 | 170.18,54.61 167.64,54.61 IC14.8 | 149.86,53.34 IC9.7 | IC14.3 170.18,73.66 170.18,71.12 | 170.18,54.61 170.18,66.04 | 170.18,66.04 170.18,68.58 | 170.18,68.58 170.18,71.12 | 170.18,71.12 IC14.4 | 170.18,68.58 IC14.5 | 170.18,66.04 IC14.6 | 116.84,68.58 116.84,66.04 IC13.6 | 116.84,68.58 116.84,71.12 IC13.4 | 116.84,68.58 IC13.5
  pour Top (isolate 0.813, no thermals): 201.93,104.14 201.93,-6.35 0,-6.35 0,104.14
  pour Bottom (isolate 0.813, no thermals): 0,92.71 0,-5.08 201.93,-5.08 201.93,92.71
N$1
  Bottom 1.422: 19.05,6.35 15.24,6.35 13.97,7.62 C3.1 13.97,16.51 12.7,17.78 D1.A | 19.05,6.35 IC12.2 | R69.1 19.05,6.35
N$2
  Bottom 0.406: IC2.4 53.34,40.64 52.07,39.37 48.26,39.37 46.99,40.64 46.99,44.45 45.72,45.72 IC3.2
N$3
  Bottom 0.406: IC2.9 67.31,35.56 62.87,31.11 59.05,31.11 52.07,38.1 IC3.10
N$4
  Top 0.813: R1.1 DIS9.7
N$5
  Bottom 0.406: IC7.14 190.5,73.66 189.23,74.93 189.23,78.11 R40.2
N$6
  Top 0.406: R40.1 182.88,87 182.25,86.36 182.25,85.09 181.99,85.09 DIS1.10
N$7
  Bottom 0.406: IC7.15 194.31,76.2 195.58,77.47 195.58,79.38 194.31,80.64 189.23,80.64 R41.2
N$8
  Top 0.406: R41.1 186.06,88.9 182.25,88.9 179.83,86.49 DIS1.9
N$9
  Bottom 0.406: R42.2 191.77,60.33 192.41,60.96 IC7.9
N$10
  Top 0.406: DIS1.2 179.83,33.78 191.77,45.72 R42.1
N$11
  Bottom 0.406: R43.2 189.23,60.96 191.77,63.5 IC7.10
N$12
  Top 0.813: R2.1 130.81,13.97 133.35,16.51 DIS9.6
N$13
  Top 0.813: DIS9.4 135.89,3.81 133.35,6.35 R3.1
N$14
  Top 0.813: DIS9.2 R4.1
N$15
  Top 0.813: DIS9.1 R5.1
N$16
  Top 0.813: R6.1 146.05,13.97 143.51,16.51 DIS9.10
N$17
  Top 0.813: R7.1 138.43,13.97 140.97,16.51 DIS9.9
N$18
  Top 0.813: R8.1 DIS8.7
N$19
  Top 0.813: DIS8.6 115.57,16.51 113.03,13.97 R9.1
N$20
  Top 0.813: DIS8.4 118.11,3.81 115.57,6.35 R10.1
N$21
  Top 0.813: DIS8.2 R11.1
N$22
  Top 0.813: DIS8.1 R12.1
N$23
  Top 0.813: R13.1 128.27,13.97 125.73,16.51 DIS8.10
N$24
  Top 0.406: DIS1.3 177.29,33.78 189.23,45.72 R43.1
N$25
  Bottom 0.406: R44.2 186.69,55.88 187.32,55.24 193.68,55.24 195.58,57.15 195.58,64.77 194.31,66.04 IC7.11
N$26
  Top 0.406: DIS1.4 174.75,33.78 186.69,45.72 R44.1
N$27
  Bottom 0.406: R45.2 190.5,82.55 191.77,83.82 194.94,83.82 198.12,80.64 198.12,72.39 194.31,68.58 IC7.12
N$28
  Top 0.406: R45.1 187.32,90.17 175.9,90.17 172.09,86.36 172.09,85.47 DIS1.6
N$29
  Bottom 0.406: IC7.13 194.31,71.12 196.85,73.66 196.85,80.01 194.94,81.92 R46.2
N$30
  Top 0.406: R46.1 191.13,85.09 185.42,85.09 182.88,82.55 175.9,82.55 174.62,83.82 174.62,85.22 DIS1.7
N$31
  Top 0.406: R47.1 144.78,85.09 143.51,83.82 134.62,83.82 133.48,84.96 DIS2.10
N$32
  Top 0.406: DIS2.9 130.94,86.49 132.08,87.63 140.97,87.63 R48.1
N$33
  Top 0.406: DIS2.2 130.94,26.8 138.43,34.29 R49.1
N$34
  Top 0.406: DIS2.3 128.4,26.8 135.89,34.29 R50.1
N$35
  Top 0.406: DIS2.4 125.86,26.8 133.35,34.29 R51.1
N$36
  Top 0.406: DIS2.6 123.32,86.49 127,90.17 146.05,90.17 R52.1
N$37
  Top 0.406: R53.1 144.78,88.9 128.27,88.9 125.73,86.36 125.73,85.47 DIS2.7
N$38
  Top 0.406: IC5.14 140.34,73.66 144.78,78.11 R47.2
N$39
  Top 0.406: IC5.15 140.97,76.2 142.24,77.47 R48.2
N$40
  Bottom 0.406: R49.2 138.43,59.69 IC5.9
N$41
  Bottom 0.406: R50.2 135.89,60.96 138.43,63.5 IC5.10
N$42
  Bottom 0.406: R51.2 133.35,58.42 134.62,59.69 134.62,62.23 138.43,66.04 IC5.11
N$43
  Top 0.406: R52.2 149.86,79.38 144.15,73.66 144.15,71.12 141.6,68.58 IC5.12
N$44
  Top 0.406: IC5.13 141.6,71.12 142.88,72.39 142.88,74.3 147.32,78.74 R53.2
N$45
  Top 0.813: DIS8.9 123.19,16.51 120.65,13.97 R14.1
N$46
  Top 0.813: R15.1 DIS7.7
N$47
  Top 0.813: DIS7.6 97.79,16.51 95.25,13.97 R16.1
N$48
  Top 0.813: DIS7.4 100.33,3.81 97.79,6.35 R17.1
N$49
  Top 0.813: DIS7.2 R18.1
N$50
  Top 0.813: DIS7.1 R19.1
N$51
  Top 0.813: R20.1 110.49,13.97 107.95,16.51 DIS7.10
N$52
  Top 0.813: DIS7.9 105.41,16.51 102.87,13.97 R21.1
N$53
  Top 0.813: R22.1 DIS6.7
N$54
  Top 0.813: DIS6.6 80.01,16.51 77.47,13.97 R23.1
N$55
  Top 0.813: DIS6.4 82.55,3.81 80.01,6.35 R24.1
N$56
  Top 0.813: DIS6.2 R25.1
N$57
  Top 0.813: DIS6.1 R26.1
N$58
  Top 0.813: R27.1 92.71,13.97 90.17,16.51 DIS6.10
N$59
  Top 0.813: DIS6.9 87.63,16.51 85.09,13.97 R28.1
N$60
  Top 0.813: R29.1 DIS5.7
N$61
  Top 0.813: DIS5.6 62.23,16.51 59.69,13.97 R30.1
N$62
  Top 0.813: DIS5.4 64.77,3.81 62.23,6.35 R31.1
N$63
  Top 0.813: DIS5.2 R32.1
N$64
  Top 0.813: DIS5.1 R33.1
N$65
  Top 0.813: R34.1 74.93,13.97 72.39,16.51 DIS5.10
N$66
  Top 0.813: DIS5.9 69.85,16.51 67.31,13.97 R35.1
N$67
  Bottom 0.406: IC15.9 JP1.3
N$68
  Bottom 0.406: IC15.10 JP1.2
N$69
  Top 0.406: IC4.12 IC4.13
  Bottom 0.406: IC4.3 IC4.12
N$70
  Bottom 1.676: J1.1 49.6,13.89 46.99,16.51 D3.A
N$71
  Bottom 0.406: IC4.4 IC4.11
N$72
  Top 0.406: IC9.8 157.48,59.05 151.76,53.34 128.27,53.34 125.73,50.8 125.73,48.26 123.19,45.72 IC15.13
N$73
  Bottom 0.406: IC9.5 IC9.4 IC9.3
N$74
  Bottom 0.406: IC9.13 154.94,73.66 153.03,71.75 153.03,65.41 151.13,63.5 IC9.6
N$75  (via drill 0.6 pad 1.42)
  Top 0.406: v161.29,60.96 152.4,52.07 128.91,52.07 127,50.16 127,46.99 123.19,43.18 IC15.12
  Bottom 0.406: IC9.12 158.75,71.12 161.29,68.58 v161.29,60.96
N$77
  Top 0.406: IC3.3 IC3.12
  Bottom 0.406: IC3.12 IC3.13
N$78
  Bottom 0.406: C2.1 Q1.2 R36.1 113.03,43.18 IC15.3
N$79
  Bottom 0.406: R37.1 110.49,34.29 109.22,35.56 106.68,35.56 105.41,36.83 C1.1 Q1.1
N$80
  Bottom 0.406: R38.2 97.79,62.23 96.52,63.5 96.52,67.31 97.79,68.58 99.06,68.58 100.33,69.85 Q2.B
N$81
  Top 0.406: IC15.4 113.03,40.64 110.49,43.18 R36.2
  Bottom 0.406: R37.2 113.03,40.64 IC15.4 IC15.11
N$82
  Bottom 0.406: LED1.K 101.6,67.31 102.87,68.58 Q2.C
N$83
  Top 0.813: LED2.K 99.06,45.72 101.6,48.26 101.6,60.96 99.06,63.5 LED1.A
N$84
  Top 0.813: R39.1 102.87,41.91 LED2.A
N$86
  Bottom 0.406: IC2.2 57.15,45.72 52.07,40.64 IC3.11
N$87
  Bottom 0.406: IC15.8 120.65,33.02 118.11,30.48 97.79,30.48 90.17,38.1 IC1.11
N$88
  Top 0.406: DIS3.10 77.47,85.09 77.47,86.36 90.17,86.36 R54.1
N$89
  Bottom 0.406: IC3.8 48.26,33.02 46.99,34.29 46.99,36.83 45.72,38.1 IC3.5 IC3.4
N$90
  Top 0.406: IC2.12 66.04,43.18 65.41,42.55 65.41,36.2 63.5,34.29 57.78,34.29 54.61,31.11 49.53,31.11 45.09,35.56 IC3.6
N$91
  Top 0.406: R55.1 89.53,83.19 75.56,83.19 74.93,83.82 74.93,85.22 DIS3.9
N$92
  Top 0.406: DIS3.2 75.06,26.8 76.2,27.94 90.17,27.94 92.71,30.48 92.71,48.26 95.25,50.8 R56.1
N$93
  Top 0.406: DIS3.3 72.52,26.8 74.93,29.21 88.9,29.21 91.44,31.75 91.44,49.53 92.71,50.8 R57.1
N$94
  Top 0.406: DIS3.4 69.98,26.8 73.66,30.48 87.63,30.48 90.17,33.02 R58.1
N$95
  Top 0.406: DIS3.6 67.44,87.76 68.58,88.9 92.71,88.9 R59.1
N$96
  Top 0.406: R60.1 91.44,87.63 71.12,87.63 69.85,86.36 69.85,85.47 DIS3.7
N$97
  Top 0.406: IC6.14 90.17,73.66 92.71,76.2 R54.2
N$98
  Top 0.406: IC6.15 88.9,76.2 90.17,77.47 R55.2
N$99
  Bottom 0.406: R56.2 95.25,59.69 93.98,60.96 IC6.9
N$100
  Top 0.406: R57.2 92.71,59.69 88.9,63.5 IC6.10
N$101
  Top 0.406: R58.2 86.36,57.15 83.82,59.69 83.82,64.77 85.09,66.04 IC6.11
N$102
  Top 0.406: IC6.12 90.17,68.58 97.79,76.2 R59.2
N$103
  Top 0.406: IC6.13 90.17,71.12 95.25,76.2 R60.2
N$104
  Top 0.406: R61.1 29.59,84.45 DIS4.10
N$105
  Top 0.406: DIS4.9 26.04,85.47 26.04,86.36 27.3,87.63 34.92,87.63 R62.1
N$106
  Top 0.406: R63.1 38.1,35.56 33.02,30.48 28.57,30.48 26.16,28.07 DIS4.2
N$107
  Top 0.406: R64.1 35.56,49.53 36.83,48.26 36.83,36.2 32.38,31.75 27.94,31.75 23.62,27.43 DIS4.3
N$108
  Top 0.406: R65.1 33.02,49.53 35.56,46.99 35.56,36.83 31.75,33.02 27.3,33.02 21.08,26.8 DIS4.4
N$109
  Top 0.406: DIS4.6 18.41,85.47 18.41,86.36 22.23,90.17 49.53,90.17 51.44,88.27 51.44,85.09 50.8,84.45 R66.1
N$110
  Top 0.406: DIS4.7 21.08,86.49 23.5,88.9 47.62,88.9 R67.1
N$111
  Top 0.406: IC8.14 34.29,73.66 36.83,76.2 36.83,80.01 40.64,83.82 R61.2
N$112
  Top 0.406: R62.2 39.37,87 38.1,85.72 38.1,83.19 35.56,80.64 35.56,77.47 34.29,76.2 IC8.15
N$113
  Top 0.406: IC8.9 33.66,60.96 38.1,56.52 R63.2
N$114
  Top 0.406: IC8.10 31.11,63.5 29.84,62.23 29.84,59.69 31.11,58.42 33.66,58.42 35.56,56.52 R64.2
N$115
  Top 0.406: IC8.11 31.11,66.04 28.57,63.5 28.57,59.05 31.75,55.88 R65.2
N$116
  Top 0.406: IC8.12 35.56,68.58 39.37,72.39 39.37,78.74 44.45,83.82 R66.2
N$117
  Top 0.406: IC8.13 35.56,71.12 38.1,73.66 38.1,79.38 42.55,83.82 42.55,85.72 43.81,87 R67.2
N$118
  Bottom 0.406: IC12.1 R69.2 R68.1
N$119
  Bottom 1.27: 11.43,45.72 15.24,49.53 D2.A | 7.62,45.72 8.26,45.72 | 7.62,45.72 6.35,45.72 6.35,34.29 7.62,34.29 | 10.16,34.29 11.43,34.29 11.43,35.56 | 11.43,35.56 11.43,45.72 | 11.43,45.72 G2.+@3 8.89,45.72 | 7.62,44.45 7.62,45.72 | 7.62,34.29 7.62,44.45 | 7.62,34.29 10.16,34.29 | 10.16,34.29 11.43,35.56 | 11.43,35.56 10.16,35.56 10.16,44.45 | 10.16,44.45 11.43,45.72 | 7.62,44.45 8.89,45.72 | 7.62,44.45 8.89,44.45 | 8.89,44.45 8.89,41.91 | 8.89,41.91 8.89,35.56 | 8.89,35.56 G2.+@2 | G2.+@1 7.62,36.83 8.89,35.56 | G2.+@4 9.53,41.27 8.89,41.91 | 8.89,44.45 10.16,44.45 | 8.89,45.72 10.16,44.45 | 8.26,45.72 8.89,45.72 | 8.26,45.72 G2.+
N$121
  Bottom 0.406: IC2.1 64.77,48.26 66.04,46.99 70.48,46.99 71.75,45.72 71.75,42.55 R70.2 74.93,39.37 81.28,39.37 82.55,38.1 82.55,30.48 83.82,29.21 95.25,29.21 96.52,27.94 146.69,27.94 165.1,9.53 165.1,4.83 S1.2
Q0
  Bottom 0.406: IC8.7 24.13,63.5 22.86,64.77 22.86,69.85 19.05,73.66 IC10.14
Q1
  Top 0.406: IC10.13 17.78,71.12 20.95,74.3 20.95,75.56 24.13,78.74 IC8.1
Q2
  Top 0.406: IC10.12 17.78,68.58 22.86,73.66 22.86,74.93 24.13,76.2 IC8.2
Q3
  Top 0.406: IC10.11 IC8.6
Q4
  Top 0.406: IC11.14 55.88,73.66 58.42,76.2 IC4.1
  Bottom 0.406: IC4.1 62.23,76.2 66.04,72.39 73.66,72.39 74.93,71.12 74.93,64.77 76.2,63.5 IC6.7
Q5
  Top 0.406: IC6.1 76.83,78.74 76.2,79.38 55.24,79.38 53.98,80.64 48.9,80.64 47.62,79.38 47.62,73.03 49.53,71.12 IC11.13
Q6
  Top 0.406: IC11.12 53.34,68.58 58.42,73.66 IC4.2 63.5,73.66 64.77,74.93 67.31,78.11 74.93,78.11 76.83,76.2 IC6.2
Q7
  Top 0.406: IC11.11 53.34,66.04 57.15,69.85 72.39,69.85 76.2,66.04 IC6.6
Q8
  Top 0.406: IC5.7 130.18,63.5 128.91,62.23 128.91,59.69 130.18,58.42 143.51,58.42 145.41,60.33 145.41,73.03 146.05,73.66 IC9.2
  Bottom 0.406: IC13.14 125.73,73.66 128.91,70.48 128.91,65.41 130.81,63.5 IC5.7
Q9
  Top 0.406: IC5.1 130.81,78.74 123.19,71.12 IC13.13
  Bottom 0.406: IC5.1 134.62,78.74 135.89,77.47 147.32,77.47 148.59,76.2 IC9.1
Q10
  Top 0.406: IC13.12 123.19,68.58 130.81,76.2 IC5.2
Q11
  Top 0.406: IC13.11 IC5.6
Q12
  Top 0.406: IC7.7 184.15,63.5 180.34,67.31 180.34,69.85 176.53,73.66 IC14.14
Q13
  Top 0.406: IC14.13 173.99,71.12 171.45,68.58 171.45,60.96 169.54,59.05 166.37,59.05 161.93,63.5 IC9.9
  Bottom 0.406: IC7.1 182.88,78.74 179.07,74.93 179.07,73.66 176.53,71.12 IC14.13
Q14
  Bottom 0.406: IC14.12 176.53,68.58 180.34,72.39 180.34,73.66 182.88,76.2 IC7.2
Q15
  Bottom 0.406: IC14.11 IC7.6
RCO1
  Top 0.406: IC11.7 45.09,63.5 46.35,62.23 46.35,60.33 48.9,57.78 61.59,57.78 63.5,59.69 63.5,65.41 62.87,66.04 IC4.5
  Bottom 0.406: IC10.15 19.05,76.2 23.5,80.64 35.56,80.64 39.37,76.83 39.37,64.77 40.64,63.5 IC11.7
RCO2
  Top 0.406: IC9.10 156.21,66.04 154.94,64.77 154.94,60.96 151.13,57.15 129.54,57.15 123.19,63.5 IC13.10
  Bottom 0.406: IC4.8 69.22,60.96 71.12,59.05 81.28,59.05 82.55,60.33 82.55,71.12 83.82,72.39 88.9,72.39 91.44,74.93 116.84,74.93 119.38,72.39 119.38,64.77 120.65,63.5 IC13.10
RCO3  (via drill 0.6 pad 1.42)
  Top 0.406: v156.21,81.28 158.75,81.28 160.02,80.01 160.02,68.58 165.1,63.5 IC14.7
  Bottom 0.406: IC13.15 125.73,76.2 130.81,81.28 138.43,81.28 140.34,83.19 153.67,83.19 155.57,81.28 v156.21,81.28
VCC  (via drill 0.6 pad 1.42)
  Top 0.406: v54.61,76.2 54.61,77.47 53.34,78.74 IC11.16
  Top 0.813: IC13.16 119.38,78.74 118.11,77.47 118.11,63.5 | IC10.1 IC10.16 | 118.11,63.5 IC13.7 C5.1 | 118.11,63.5 120.65,60.96 IC13.9
  Bottom 0.406: v54.61,76.2 54.61,64.77 53.34,63.5 IC11.10 IC11.9 | 17.78,63.5 2.54,63.5 2.54,81.28
  Bottom 0.813: 167.64,92.08 167.64,84.45 172.09,80.01 172.09,78.74 | IC14.16 172.09,78.74 | 158.75,92.08 158.75,76.83 158.12,76.2 IC9.14 | IC13.16 121.92,80.01 116.84,85.09 116.84,92.08 | IC4.14 68.58,77.47 63.5,82.55 63.5,92.08 | 53.34,92.08 53.34,80.64 51.44,78.74 IC11.16 | 173.99,60.96 173.35,60.96 172.09,62.23 172.09,63.5 | 173.99,60.96 IC14.9 | 172.09,78.74 172.09,63.5 | 2.54,78.74 IC10.1 | IC10.7 IC10.10 IC10.9 | IC2.14 C6.1 68.58,53.34 | 87.63,50.8 IC1.16 | 50.8,53.34 IC3.14 | 172.09,63.5 IC14.10 | 173.99,60.96 C7.1
  Bottom 1.27: 123.83,48.9 123.19,48.26 IC15.14 | JP1.1 127,45.72 123.83,48.9 | 123.83,48.9 C8.1 118.75,53.98 104.78,53.98 100.33,49.53 88.9,49.53 87.63,50.8 85.09,53.34 68.58,53.34 50.8,53.34 27.94,53.34 17.78,63.5 IC10.10 2.54,63.5 | 116.84,92.08 113.03,92.08 | 167.64,92.08 163.83,92.08 | 2.54,55.88 D2.C
  Bottom 1.422: 2.54,17.78 D1.C
  Bottom 1.676: 167.64,92.08 158.75,92.08 116.84,92.08 108.58,92.08 105.41,89.53 95.25,89.53 92.08,92.08 63.5,92.08 53.34,92.08 13.97,92.08 2.54,81.28 2.54,78.74 2.54,63.5 2.54,55.88 2.54,17.78
(copper drawn outside any net)
  shapes: Bottom area x5513, Top area x5513

### Text on the board
Top: 74 Clock | Arthur Benemann | http://code.google.com/p/74clock/ | REV 1.0
Bottom: http://code.google.com/p/74clock/ | Arthur Benemann | 74 Clock | REV 1.0